# Altium schematic sheet TopLevel.SchDoc
size A4
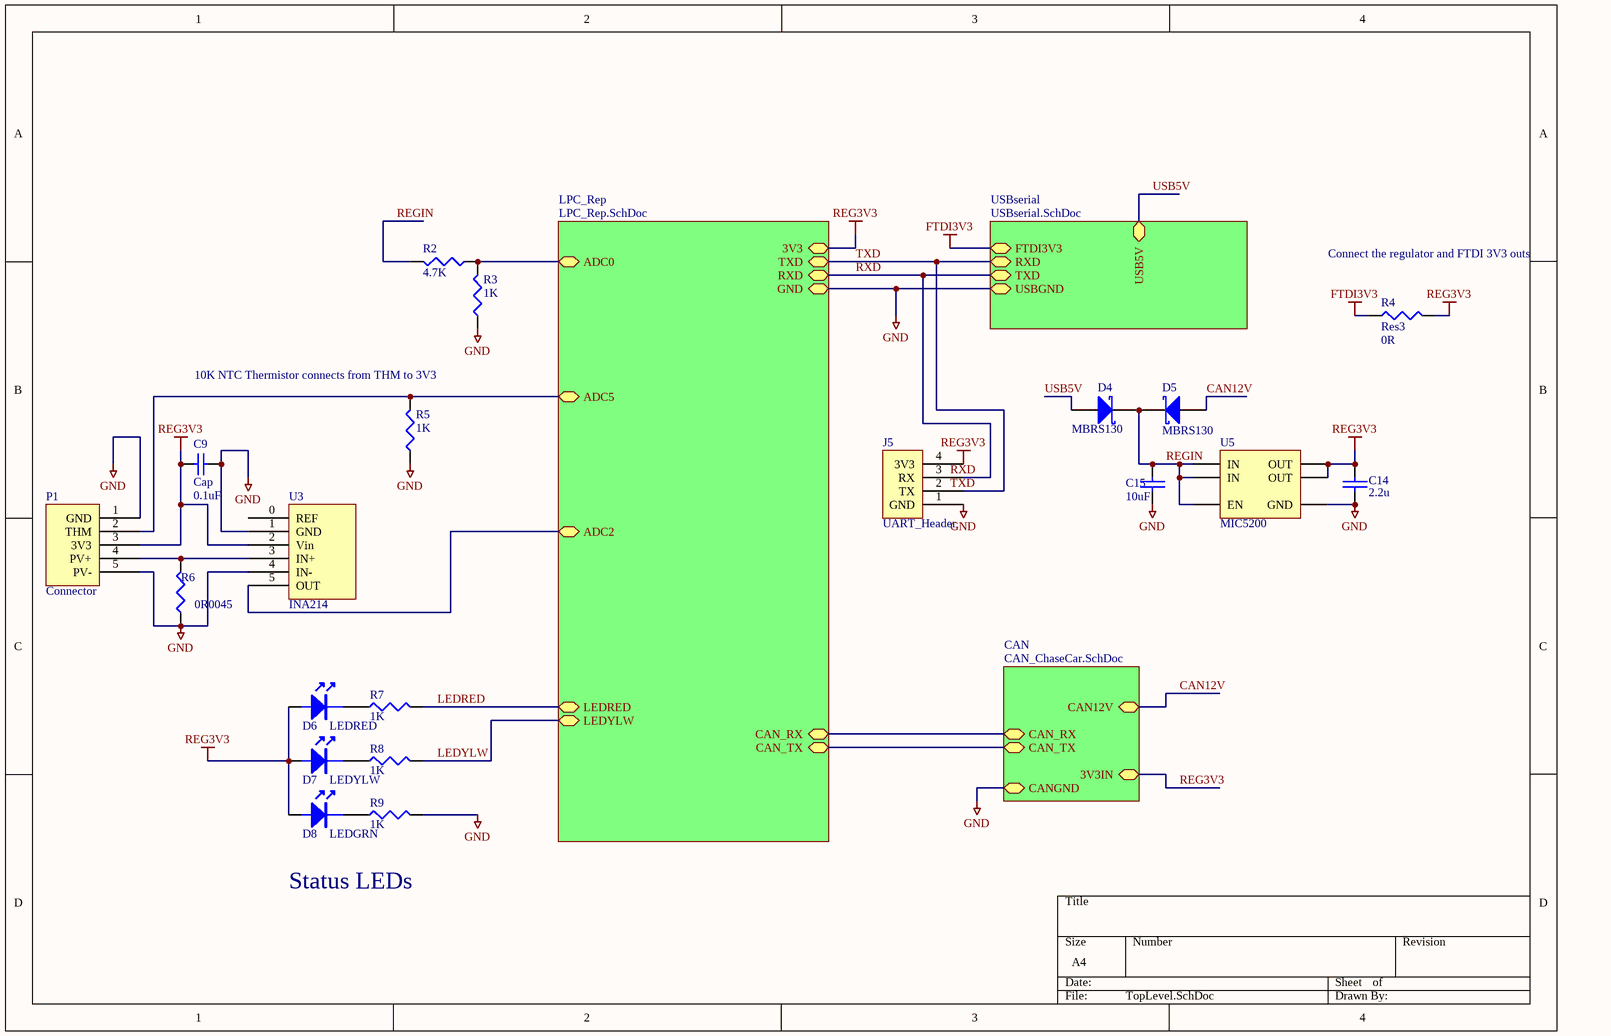
[diagram p0: TopLevel.SchDoc]

## Parts
C9  Cap  value 0.1uF  [0603]
C14  2.2u  [0603]
C15  value 10uF  [0805]  (hidden comment: 10u)
D4  MBRS130  [SMB]
D5  MBRS130  [SMB]
D6  LEDRED  [0805LED]
D7  LEDYLW  [0805LED]
D8  LEDGRN  [0805LED]
J5  UART_Header  [IDC4]
P1  Connector  [TermBlock5]
R2  4.7K  [0603]
R3  1K  [0603]
R4  Res3  value 0R  [0603]
R5  1K  [0603]
R6  0R0045  [1206]
R7  1K  [0603]
R8  1K  [0603]
R9  1K  [0603]
U3  INA214  [SOP6 - INA214]
U5  MIC5200  [SO8]

## Sub-sheets
CAN = CAN_ChaseCar.SchDoc: CAN12V, CAN_RX, CAN_TX, 3V3IN, CANGND
LPC_Rep = LPC_Rep.SchDoc: ADC0, ADC5, TXD, RXD, LEDRED, LEDYLW, ADC2, 3V3, GND, CAN_TX, CAN_RX
USBserial = USBserial.SchDoc: RXD, TXD, FTDI3V3, USBGND, USB5V

## Nets
FTDI3V3: R4.1 ; sheet USBserial/FTDI3V3
GND: C9.2 C14.1 C15.2 J5.1(GND) P1.1(GND) P1.5(PV-) R3.1 R5.1 R6.1 R9.2 U3.1(GND) U3.4(IN-) U5.4(GND) ; sheet LPC_Rep/GND, sheet USBserial/USBGND, sheet CAN/CANGND
REG3V3: C9.1 C14.2 D6.A D7.A D8.A J5.4(3V3) P1.3(3V3) R4.2 U3.2(Vin) U5.1(OUT) U5.2(OUT) ; sheet LPC_Rep/3V3, sheet CAN/3V3IN
CAN12V: D5.A ; sheet CAN/CAN12V
LEDRED: R7.2 ; sheet LPC_Rep/LEDRED
LEDYLW: R8.2 ; sheet LPC_Rep/LEDYLW
REGIN: C15.1 D4.K D5.K R2.2 U5.5(EN) U5.7(IN) U5.8(IN)
RXD: J5.3(RX) ; sheet LPC_Rep/RXD, sheet USBserial/TXD
TXD: J5.2(TX) ; sheet LPC_Rep/TXD, sheet USBserial/RXD
USB5V: D4.A ; sheet USBserial/USB5V
NetD6_K: D6.K R7.1
NetD7_K: D7.K R8.1
NetD8_K: D8.K R9.1
NetP1_2: P1.2(THM) R5.2 ; sheet LPC_Rep/ADC5
NetP1_4: P1.4(PV+) R6.2 U3.3(IN+)
NetR2_1: R2.1 R3.2 ; sheet LPC_Rep/ADC0
NetU3_5: U3.5(OUT) ; sheet LPC_Rep/ADC2
(unnamed): sheet LPC_Rep/CAN_TX, sheet CAN/CAN_TX
(unnamed): sheet LPC_Rep/CAN_RX, sheet CAN/CAN_RX

Not connected (* = marked no-connect by the designer): U3 0(REF)

## Notes on the sheet
- Connect the regulator and FTDI 3V3 outs
- (near R5) 10K NTC Thermistor connects from THM to 3V3
- Status LEDs
- Labels drawn without touching a wire or pin: RXD, TXD

## Library data of the parts
C9 = Cap: Capacitor; Published: 8-Jun-2000; LatestRevisionDate: 17-Jul-2002; LatestRevisionNote: Re-released for DXP Platform.; PackageReference: RAD-0.3; Publisher: Altium Limited; PackageDescription: Radial Cap, Thru-Hole; 2 Leads; 0.3 in Pin Spacing
C14 = CAP: Capacitor; Something: 0.938; Value: 2.2uF; Needed?: Farnell; RS: 643-3771; RS Price: 0.07; Supplier: Farnell.; Farnell: 1683525; Farnell Price: 0.04
C15 = CAP: Capacitor; Needed?: Farnell; Farnell: 1844290; Farnell Price: 0.15
D4 D5 = D SCHOTTKY: Schottky Diode; Needed?: Unsure - RS; RS: 625-5278; RS Price: 0.39; Revision: July-2002: Re-released for DXP Platform.; Farnell: 708-150; Farnell Price: 2.09
D6-D8 = LED
J5 = UART_Header: Needed?: NO - Common
P1 = CONN
R2 R3 R5-R9 = RES1: Resistor; Order#: 9331697; Supplier: Farnell; Price: 0.05
R4 = Res3: Resistor; Published: 8-Jun-2000; LatestRevisionDate: 29-May-2009; LatestRevisionNote: IPC-7351 Footprint Added.; PackageReference: J1-0603; Publisher: Altium Limited; PackageDescription: Chip Resistor
U5 = MIC5200: MIC5200 - SO8; Needed?: Farnell; Part Field 2: 2.00; Part Field 3: Computer Science and Engineering; Part Field 4: David Johnson; Farnell: 1213488; Farnell Price: 3.62